# EAGLE design analogBoardV1_2 (EAGLE 6.4)
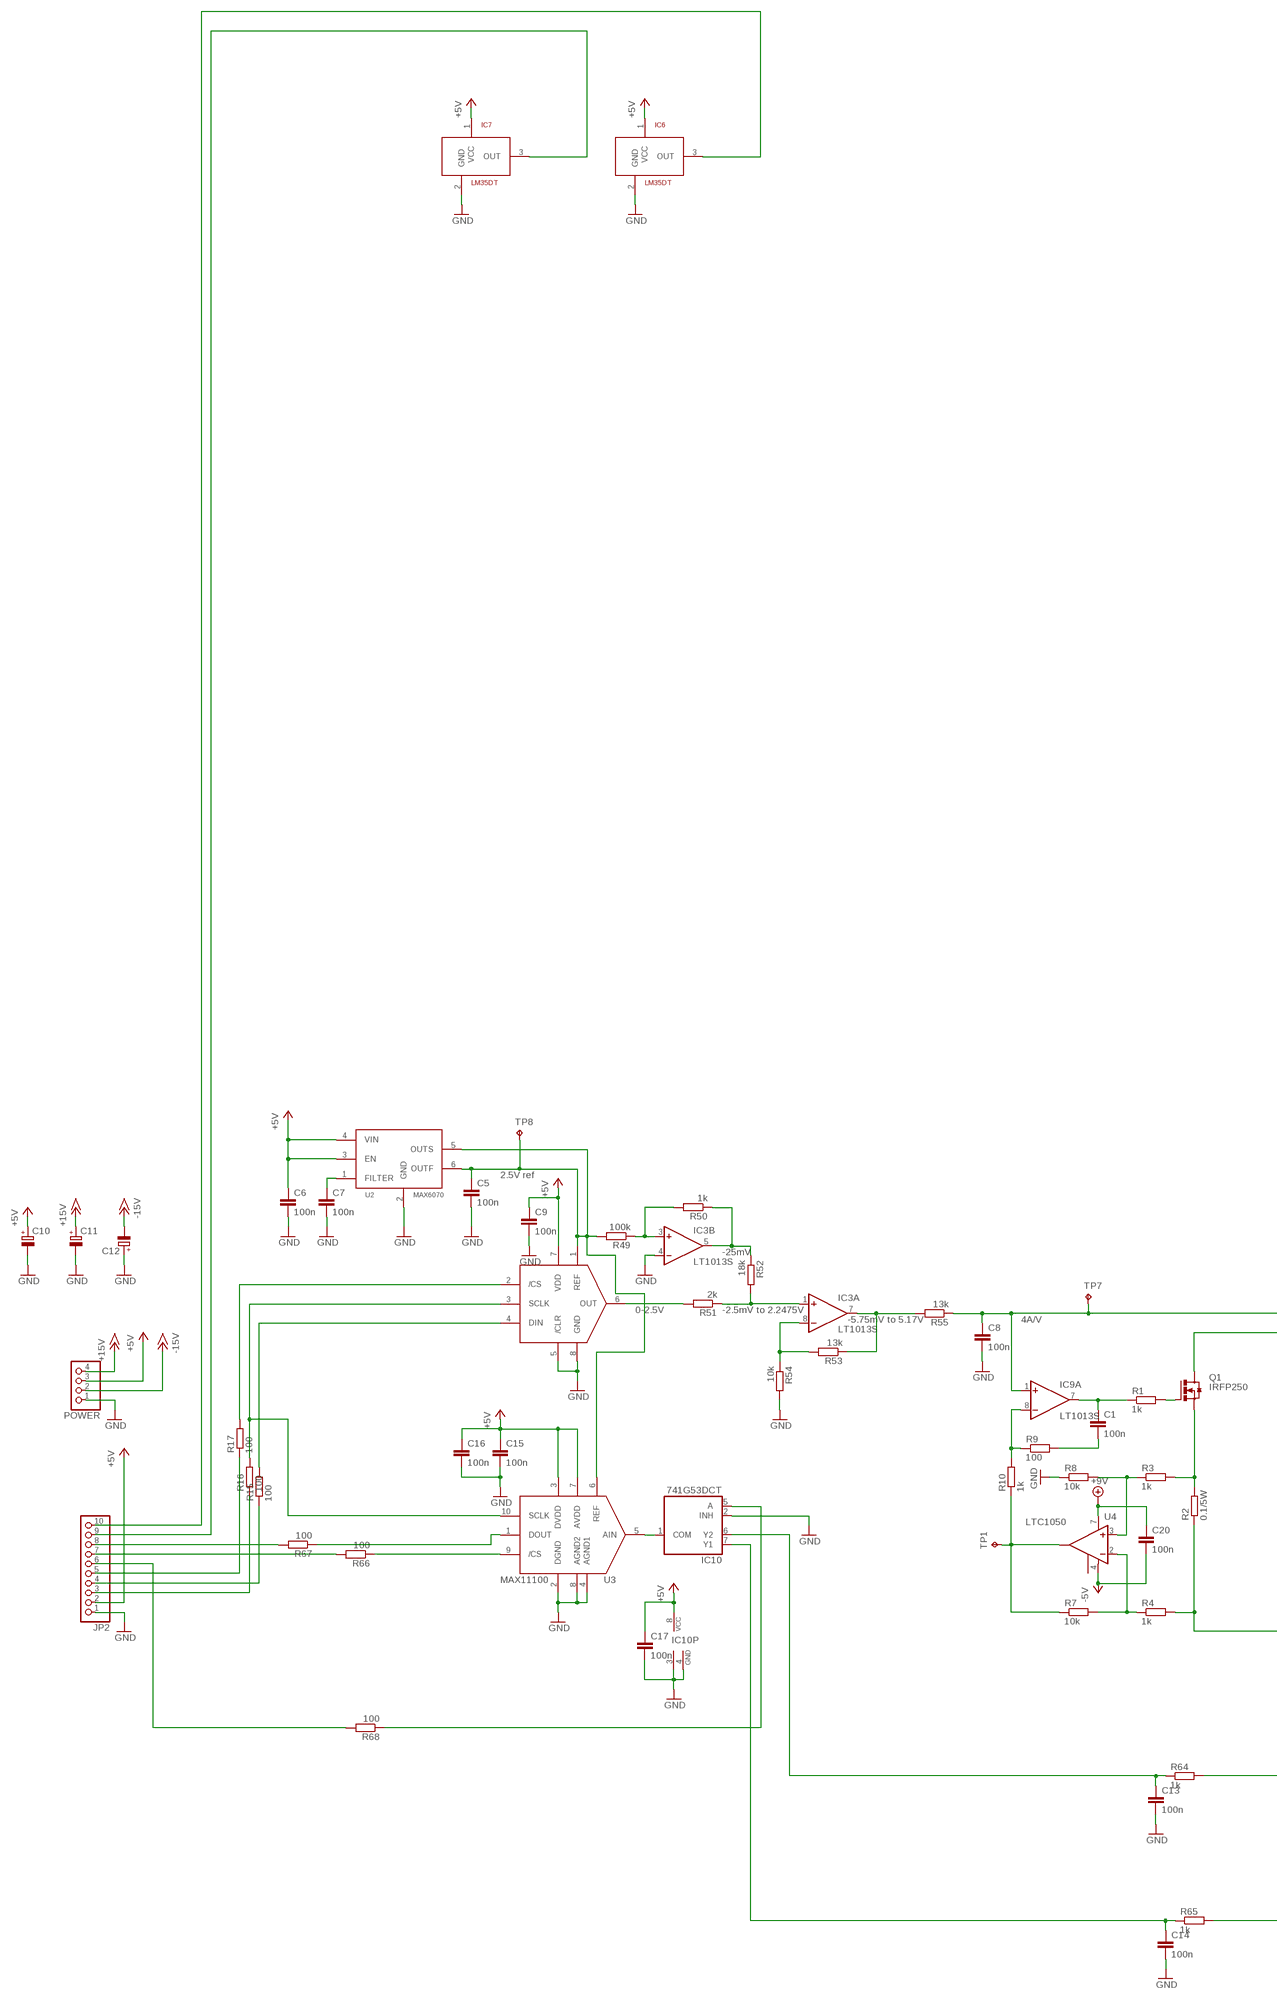
[diagram p0: schematic, sheet 1, part 1 of 2]
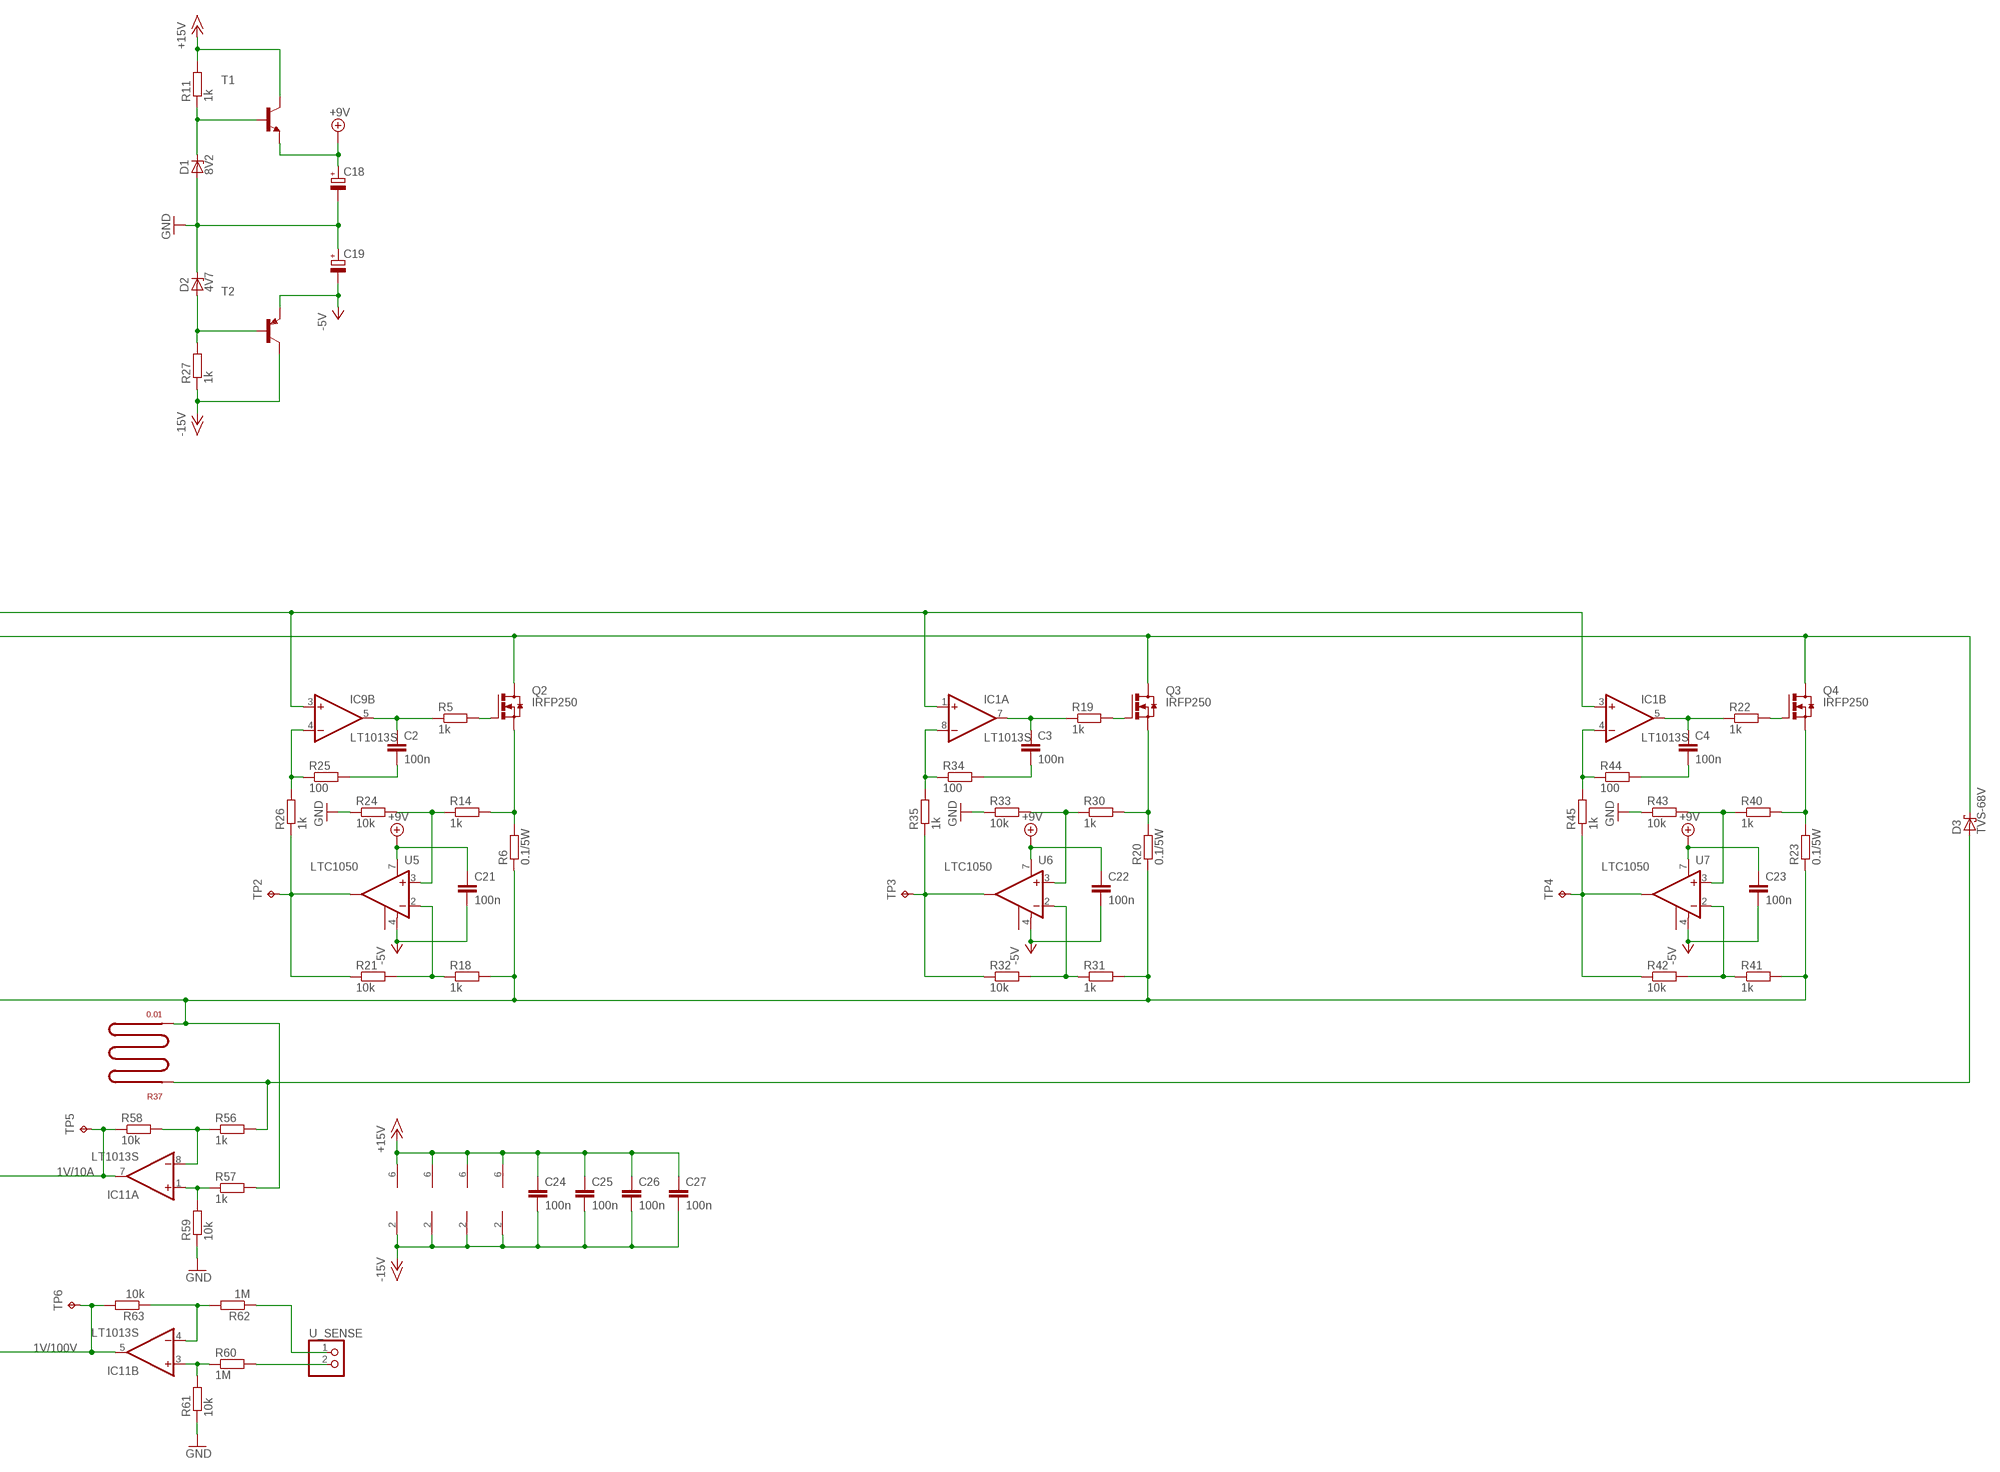
[diagram p1: schematic, sheet 1, part 2 of 2]

## Parts
C1  100n  C-EUC0603K  [C0603K]
C2  100n  C-EUC0603K  [C0603K]
C3  100n  C-EUC0603K  [C0603K]
C4  100n  C-EUC0603K  [C0603K]
C5  100n  C-EUC0603K  [C0603K]
C6  100n  C-EUC0603K  [C0603K]
C7  100n  C-EUC0603K  [C0603K]
C8  100n  C-EUC0603K  [C0603K]
C9  100n  C-EUC0603K  [C0603K]
C10  CPOL-EUE2.5-6  [E2,5-6]
C11  CPOL-EUE2.5-6  [E2,5-6]
C12  CPOL-EUE2.5-6  [E2,5-6]
C13  100n  C-EUC0603K  [C0603K]
C14  100n  C-EUC0603K  [C0603K]
C15  100n  C-EUC0603K  [C0603K]
C16  100n  C-EUC0603K  [C0603K]
C17  100n  C-EUC0603K  [C0603K]
C18  CPOL-EUE2.5-6  [E2,5-6]
C19  CPOL-EUE2.5-6  [E2,5-6]
C20  100n  C-EUC0603K  [C0603K]
C21  100n  C-EUC0603K  [C0603K]
C22  100n  C-EUC0603K  [C0603K]
C23  100n  C-EUC0603K  [C0603K]
C24  100n  C-EUC0603K  [C0603K]
C25  100n  C-EUC0603K  [C0603K]
C26  100n  C-EUC0603K  [C0603K]
C27  100n  C-EUC0603K  [C0603K]
D1  8V2  ZENER-DIODESOT23  [SOT23]
D2  4V7  ZENER-DIODESOT23  [SOT23]
D3  TVS-68V  SCHOTTKY-DIODECB429-15  [CB429-15]
IC1  LT1013S  [SO08]
IC3  LT1013S  [SO08]
IC6  LM35DT  [TO220V]
IC7  LM35DT  [TO220V]
IC9  LT1013S  [SO08]
IC10  741G53DCT  [DCT_R-PDSO-G8]
IC11  LT1013S  [SO08]
JP2  PINHD-1X10  [1X10]
POWER  PINHD-1X4  [1X04]
Q1  IRFP250  [TO-247AD-V]
Q2  IRFP250  [TO-247AD-V]
Q3  IRFP250  [TO-247AD-V]
Q4  IRFP250  [TO-247AD-V]
R1  1k  R-EU_R0603  [R0603]
R2  0.1/5W  5WAXIAL  [5WAXIAL]
R3  1k  R-EU_R0603  [R0603]
R4  1k  R-EU_R0603  [R0603]
R5  1k  R-EU_R0603  [R0603]
R6  0.1/5W  5WAXIAL  [5WAXIAL]
R7  10k  R-EU_R0603  [R0603]
R8  10k  R-EU_R0603  [R0603]
R9  100  R-EU_R0603  [R0603]
R10  1k  R-EU_R0603  [R0603]
R11  1k  R-EU_R0603  [R0603]
R14  1k  R-EU_R0603  [R0603]
R15  100  R-EU_R0603  [R0603]
R16  100  R-EU_R0603  [R0603]
R17  100  R-EU_R0603  [R0603]
R18  1k  R-EU_R0603  [R0603]
R19  1k  R-EU_R0603  [R0603]
R20  0.1/5W  5WAXIAL  [5WAXIAL]
R21  10k  R-EU_R0603  [R0603]
R22  1k  R-EU_R0603  [R0603]
R23  0.1/5W  5WAXIAL  [5WAXIAL]
R24  10k  R-EU_R0603  [R0603]
R25  100  R-EU_R0603  [R0603]
R26  1k  R-EU_R0603  [R0603]
R27  1k  R-EU_R0603  [R0603]
R30  1k  R-EU_R0603  [R0603]
R31  1k  R-EU_R0603  [R0603]
R32  10k  R-EU_R0603  [R0603]
R33  10k  R-EU_R0603  [R0603]
R34  100  R-EU_R0603  [R0603]
R35  1k  R-EU_R0603  [R0603]
R37  0.01  SHUNT  [COPPERSHUNT]
R40  1k  R-EU_R0603  [R0603]
R41  1k  R-EU_R0603  [R0603]
R42  10k  R-EU_R0603  [R0603]
R43  10k  R-EU_R0603  [R0603]
R44  100  R-EU_R0603  [R0603]
R45  1k  R-EU_R0603  [R0603]
R49  100k  R-EU_R0603  [R0603]
R50  1k  R-EU_R0603  [R0603]
R51  2k  R-EU_R0603  [R0603]
R52  18k  R-EU_R0603  [R0603]
R53  13k  R-EU_R0603  [R0603]
R54  10k  R-EU_R0603  [R0603]
R55  13k  R-EU_R0603  [R0603]
R56  1k  R-EU_R0603  [R0603]
R57  1k  R-EU_R0603  [R0603]
R58  10k  R-EU_R0603  [R0603]
R59  10k  R-EU_R0603  [R0603]
R60  1M  R-EU_R0603  [R0603]
R61  10k  R-EU_R0603  [R0603]
R62  1M  R-EU_R0603  [R0603]
R63  10k  R-EU_R0603  [R0603]
R64  1k  R-EU_R0603  [R0603]
R65  1k  R-EU_R0603  [R0603]
R66  100  R-EU_R0603  [R0603]
R67  100  R-EU_R0603  [R0603]
R68  100  R-EU_R0603  [R0603]
T1  BC817-16-NPN-SOT23-BEC  [SOT23-BEC]
T2  BC807-16-PNP-SOT23-BEC  [SOT23-BEC]
TP1  TPB1,27  [B1,27]
TP2  TPB1,27  [B1,27]
TP3  TPB1,27  [B1,27]
TP4  TPB1,27  [B1,27]
TP5  TPB1,27  [B1,27]
TP6  TPB1,27  [B1,27]
TP7  TPB1,27  [B1,27]
TP8  TPB1,27  [B1,27]
U1  MAX5216  [UMAX8]
U2  MAX6070  [SOT23-6L]
U3  MAX11100  [UMAX10]
U4  LTC1050  [SOIC8]
U5  LTC1050  [SOIC8]
U6  LTC1050  [SOIC8]
U7  LTC1050  [SOIC8]
U_SENSE  PINHD-1X2  [1X02]

## Nets
1M: R62.1 U_SENSE.1
+5V: C6.1 C9.1 C10.+ C15.1 C16.1 C17.1 IC6.1(VCC) IC7.1(VCC) IC10.8(VCC) JP2.2 POWER.3 U1.7(VDD) U2.3(EN) U2.4(VIN) U3.3(DVDD) U3.7(AVDD)
+9V: C18.+ C20.1 C21.1 C22.1 C23.1 T1.E U4.7(V+) U5.7(V+) U6.7(V+) U7.7(V+)
+15V: C11.+ C24.1 C25.1 C26.1 C27.1 IC1.6(P:V+) IC3.6(P:V+) IC9.6(P:V+) IC11.6(P:V+) POWER.4 R11.2 T1.C
-5V: C19.- C20.2 C21.2 C22.2 C23.2 T2.E U4.4(V-) U5.4(V-) U6.4(V-) U7.4(V-)
-15V: C12.- C24.2 C25.2 C26.2 C27.2 IC1.2(P:V-) IC3.2(P:V-) IC9.2(P:V-) IC11.2(P:V-) POWER.2 R27.1 T2.C
GND: C5.2 C6.2 C7.2 C8.2 C9.2 C10.- C11.- C12.+ C13.2 C14.2 C15.2 C16.2 C17.2 C18.- C19.+ D1.1(A) D2.3(C) IC3.4(B:-IN) IC6.2(GND) IC7.2(GND) IC10.2(INH) IC10.3(GND) IC10.4(GND) JP2.1 POWER.1 R8.1 R24.1 R33.1 R43.1 R54.2 R59.1 R61.1 U1.5(/CLR) U1.8(GND) U2.2(GND) U3.2(DGND) U3.4(AGND1) U3.8(AGND2)
N$1: R2.1 R4.2 R6.1 R18.2 R20.1 R23.1 R31.2 R37.P$2 R41.2 R57.2
N$2: Q1.G R1.2
N$3: Q1.S R2.2 R3.2
N$4: R4.1 R7.2 U4.2(-IN)
N$5: R3.1 R8.2 U4.3(+IN)
N$7: Q2.G R5.2
N$8: Q2.S R6.2 R14.2
N$9: C1.1 IC9.7(A:OUT) R1.1
N$10: C1.2 R9.2
N$11: R7.1 R10.1 TP1.TP U4.6(OUT)
N$12: IC9.8(A:-IN) R9.1 R10.2
N$13: D1.3(C) R11.1 T1.B
N$14: D2.1(A) R27.2 T2.B
N$15: Q3.G R19.2
N$18: R15.2 U1.4(DIN)
N$19: Q3.S R20.2 R30.2
N$21: R16.2 U1.3(SCLK) U3.10(SCLK)
N$22: R17.2 U1.2(/CS)
N$24: C8.1 IC1.1(A:+IN) IC1.3(B:+IN) IC9.1(A:+IN) IC9.3(B:+IN) R55.1 TP7.TP
N$25: C7.1 U2.1(FILTER)
N$26: Q4.G R22.2
N$27: Q4.S R23.2 R40.2
N$28: C5.1 R49.2 TP8.TP U1.1(REF) U2.5(OUTS) U2.6(OUTF) U3.6(REF)
N$29: R51.2 U1.6(OUT)
N$30: R18.1 R21.2 U5.2(-IN)
N$31: R14.1 R24.2 U5.3(+IN)
N$32: C2.1 IC9.5(B:OUT) R5.1
N$33: C2.2 R25.2
N$34: R21.1 R26.1 TP2.TP U5.6(OUT)
N$35: IC9.4(B:-IN) R25.1 R26.2
N$38: IC3.3(B:+IN) R49.1 R50.2
N$39: IC3.5(B:OUT) R50.1 R52.1
N$44: IC3.1(A:+IN) R51.1 R52.2
N$45: IC3.8(A:-IN) R53.2 R54.1
N$46: R31.1 R32.2 U6.2(-IN)
N$47: R30.1 R33.2 U6.3(+IN)
N$48: C3.1 IC1.7(A:OUT) R19.1
N$49: JP2.5 R17.1
N$50: JP2.3 R16.1
N$51: JP2.4 R15.1
N$52: C3.2 R34.2
N$53: IC6.3(OUT) JP2.10
N$54: IC7.3(OUT) JP2.9
N$55: R32.1 R35.1 TP3.TP U6.6(OUT)
N$56: IC1.8(A:-IN) R34.1 R35.2
N$64: IC3.7(A:OUT) R53.1 R55.2
N$65: IC10.1(COM) U3.5(AIN)
N$66: R41.1 R42.2 U7.2(-IN)
N$67: R40.1 R43.2 U7.3(+IN)
N$68: C4.1 IC1.5(B:OUT) R22.1
N$69: C4.2 R44.2
N$70: R42.1 R45.1 TP4.TP U7.6(OUT)
N$71: IC1.4(B:-IN) R44.1 R45.2
N$74: D3.A R37.P$1 R56.2
N$79: IC11.5(B:OUT) R63.2 R65.2 TP6.TP
N$80: IC11.8(A:-IN) R56.1 R58.2
N$81: IC11.1(A:+IN) R57.1 R59.2
N$82: C13.1 IC10.6(Y2) R64.1
N$83: IC11.7(A:OUT) R58.1 R64.2 TP5.TP
N$84: R60.2 U_SENSE.2
N$85: IC11.3(B:+IN) R60.1 R61.2
N$86: IC11.4(B:-IN) R62.2 R63.1
N$88: C14.1 IC10.7(Y1) R65.1
N$89: IC10.5(A) R68.1
N$90: JP2.7 R66.2
N$91: R67.1 U3.1(DOUT)
N$92: R66.1 U3.9(/CS)
N$93: JP2.8 R67.2
N$94: JP2.6 R68.2
POS_INPUT1: D3.C Q1.D Q2.D Q3.D Q4.D
Unconnected: U4.5(REFCLK) U5.5(REFCLK) U6.5(REFCLK) U7.5(REFCLK)

## Notes on the sheet
- 2.5V ref
- -25mV
- 0-2.5V | -2.5mV to 2.2475V
- -5.75mV to 5.17V | 4A/V
- 1V/10A
- 1V/100V

## Library data of the parts
C1-C9 C13-C17 C20-C27 = rcl:C-EU: CAPACITOR, European symbol
C10-C12 C18 C19 = rcl:CPOL-EU: POLARIZED CAPACITOR, European symbol
D1 D2 = diode:ZENER-DIODE: Z-Diode
D3 = diode:SCHOTTKY-DIODE: Schottky Diode
IC1 IC3 IC9 IC11 = synthdiy:LT1013: OP AMP
IC6 IC7 = customSensors:LM35DT
IC10 = 74xx-little-us:74*1G53: SINGLE-POLE DOUBLE-THROW (SPDT) ANALOG SWITCH 2:1 ANALOG MULTIPLEXER/DEMULTIPLEXER Source: http://focus.ti.com/lit/ds/symlink/sn74lvc2g53.pdf
JP2 = pinhead:PINHD-1X10: PIN HEADER
POWER = pinhead:PINHD-1X4: PIN HEADER
Q1-Q4 = transistor-power:IRFP25*: 33A/27A, 200V/150V, 0.085/0.012 Ohm, N-Channel Power MOSFET Source: Fairchild Semiconductor Corporation
R1 R3-R5 R7-R11 R14-R19 R21 R22 R24-R27 R30-R35 R40-R45 R49-R68 = resistor:R-EU_: RESISTOR, European symbol
R2 R6 R20 R23 = resistormod:5WAXIAL
R37 = customResistor:SHUNT
T1 = transistor:*-NPN-: NPN Transistror BF959 corrected 2008.03.06
T2 = transistor:*-PNP-: PNP Transistror
TP1-TP8 = testpad:TP: Test pad
U1 = maxim:MAX5216
U2 = maxim:MAX6070
U3 = maxim:MAX11100
U4-U7 = linear-technology:LTC1050
U_SENSE = pinhead:PINHD-1X2: PIN HEADER

## Board
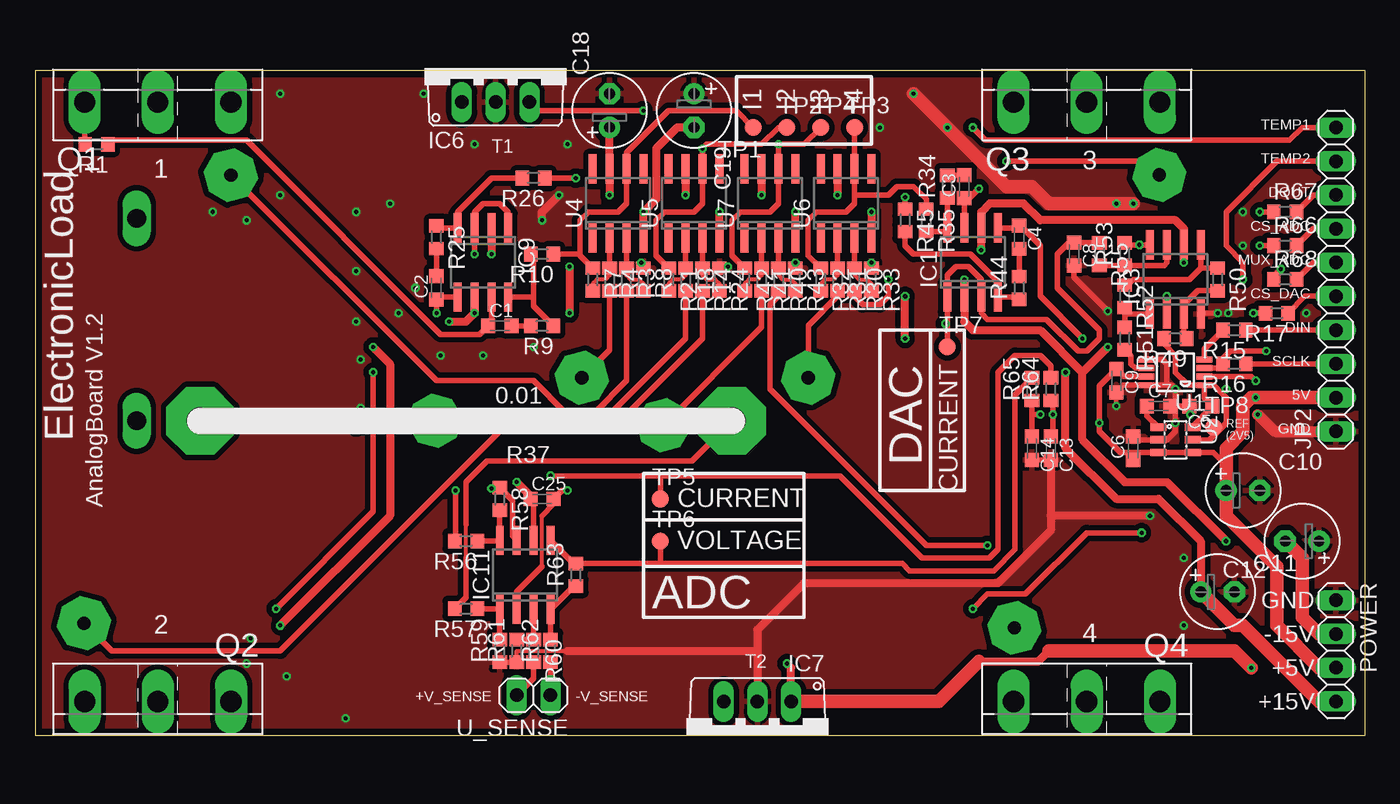
[diagram p2: board, top side]
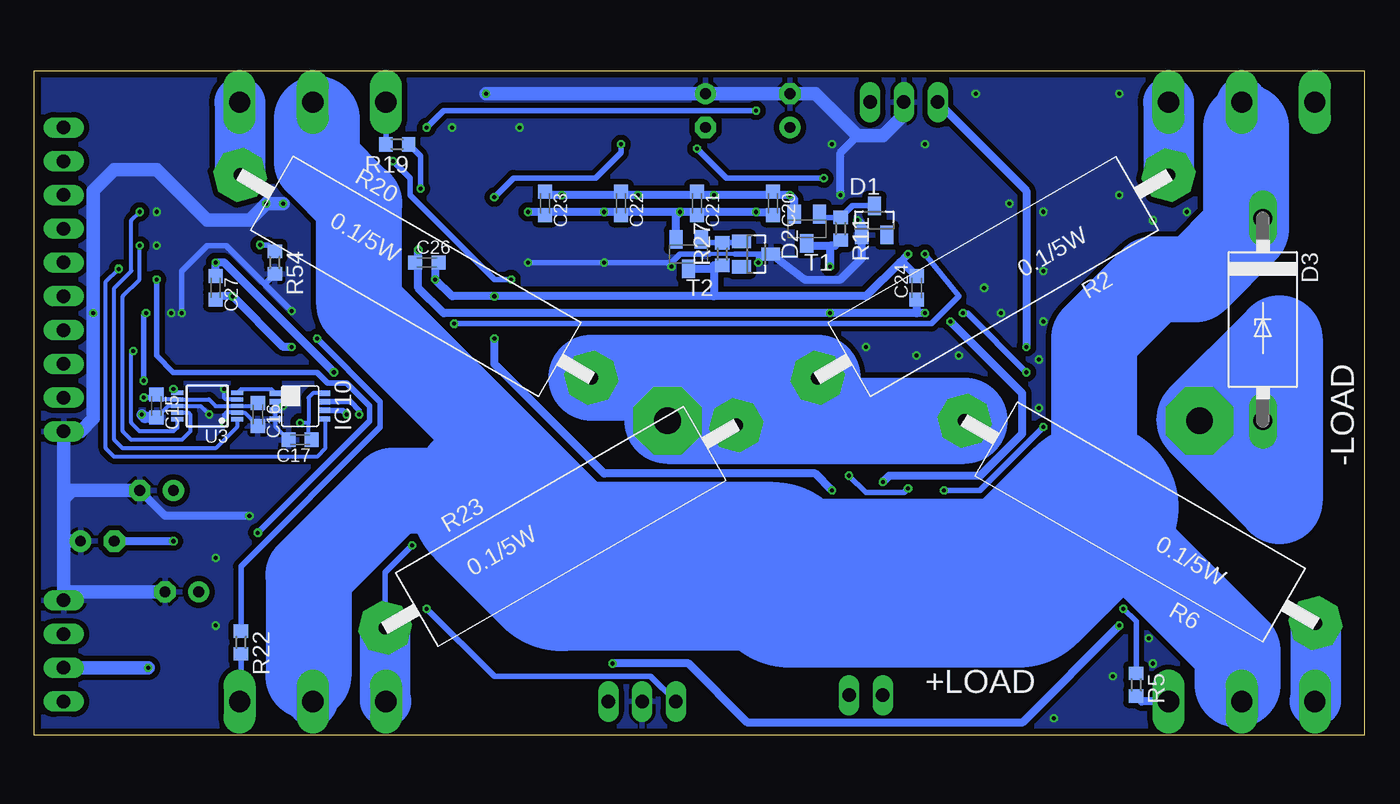
[diagram p3: board, bottom side, seen from below]

Size 100 x 50 mm. Coordinates in mm from the lower left corner, seen from the top.
Outline: 0,0 100,0 100,50 0,50 0,0
Copper layers (1*16): Top 0.035mm / dielectric 1.6mm / Bottom 0.035mm
Design rules "Elecrow_2-layer_PCB_eagle_rule": minimum track width 6mil, minimum drill 12mil, track to track 6mil, track to pad 6mil, pad to pad 6mil, via to via 8mil, smd to smd 0mil, copper to edge 20mil, drill to drill 10mil, minimum pad ring 6mil, minimum via ring 6mil, stop-mask expansion 0mil, vias tented up to drill 100mil, thermal gap 10mil

### Footprints (pad centres in the part's own frame; a part is rotated, then mirrored left to right if it is on the bottom)
C0603K = smd 1.05 x 1.08: 1 -0.875,0; 2 0.875,0
E2,5-6 = drill 0.813 pad 1.6: + -1.27,0 | drill 0.813 pad 1.6 octagon: - 1.27,0
SOT23 = smd 1 x 1.4: 1 -0.95,-1.1; 2 0.95,-1.1; 3 0,1.1
CB429-15 = drill 1.397 long: A 7.62,0; C -7.62,0
SO08 = smd 0.6 x 2.2: 1 -1.905,-2.6; 2 -0.635,-2.6; 3 0.635,-2.6; 4 1.905,-2.6; 5 1.905,2.6; 6 0.635,2.6; 7 -0.635,2.6; 8 -1.905,2.6
TO220V = drill 1.016 long: 1 -2.54,-2.54; 2 0,-2.54; 3 2.54,-2.54
DCT_R-PDSO-G8 = smd 0.4 x 0.8: 1 -0.975,-1.875; 2 -0.325,-1.875; 3 0.325,-1.875; 4 0.975,-1.875; 5 0.975,1.875; 6 0.325,1.875; 7 -0.325,1.875; 8 -0.975,1.875
1X10 = drill 1.016 long: 1 -11.43,0; 2 -8.89,0; 3 -6.35,0; 4 -3.81,0; 5 -1.27,0; 6 1.27,0; 7 3.81,0; 8 6.35,0; 9 8.89,0; 10 11.43,0
1X04 = drill 1.016 long: 1 -3.81,0; 2 -1.27,0; 3 1.27,0; 4 3.81,0
TO-247AD-V = drill 1.6 long: D 0,-2.54; G -5.5,-2.54; S 5.5,-2.54
R0603 = smd 1 x 1.1: 1 -0.85,0; 2 0.85,0
5WAXIAL = drill 1 pad 3.81 octagon: 1 15.24,0; 2 -15.24,0
COPPERSHUNT = drill 2 pad 5.08 octagon: P$1 20,0; P$2 -20,0
SOT23-BEC = smd 1 x 1.4: B -0.95,-1.1; C 0,1.1; E 0.95,-1.1
B1,27 = smd 1.27 x 1.27: TP 0,0
UMAX8 = smd 0.45 x 1.2: 1 -0.975,-2.175; 2 -0.325,-2.175; 3 0.325,-2.175; 4 0.975,-2.175; 5 0.975,2.175; 6 0.325,2.175; 7 -0.325,2.175; 8 -0.975,2.175
SOT23-6L = smd 0.55 x 1.2: 1 -0.95,-1.3; 2 0,-1.3; 3 0.95,-1.3; 4 0.95,1.3; 5 0,1.3; 6 -0.95,1.3
UMAX10 = smd 0.32 x 0.9: 1 -1,-2.25; 2 -0.5,-2.25; 3 0,-2.25; 4 0.5,-2.25; 5 1,-2.25; 6 1,2.25; 7 0.5,2.25; 8 0,2.25; 9 -0.5,2.25; 10 -1,2.25
SOIC8 = smd 0.6 x 2.2: 1 -1.905,-2.6; 2 -0.635,-2.6; 3 0.635,-2.6; 4 1.905,-2.6; 5 1.905,2.6; 6 0.635,2.6; 7 -0.635,2.6; 8 -1.905,2.6
1X02 = drill 1.016 long: 1 -1.27,0; 2 1.27,0

### Placement (x,y rotation side)
C1  34.92,30.8 0 top
C2  30.16,33.66 90 top
C3  69.85,41.27 90 top
C4  73.98,37.47 270 top
C5  87.63,24.77 180 top
C6  82.55,21.59 90 top
C7  84.45,24.77 0 top
C8  78.11,36.2 270 top
C9  81.28,26.67 270 top
C10  90.81,18.41 0 top
C11  88.9,10.79 0 top
C12  95.25,14.61 180 top
C13  76.36,21.59 270 top
C14  74.93,21.59 270 top
C15  90.81,24.77 270 bottom
C16  83.19,24.13 270 bottom
C17  80.01,22.23 180 bottom
C18  43.18,46.99 90 top
C19  49.53,46.99 270 top
C20  44.45,40.01 270 bottom
C21  50.16,40.01 270 bottom
C22  55.88,40.01 270 bottom
C23  61.59,40.01 270 bottom
C24  33.66,33.66 90 bottom
C25  38.1,17.78 0 top
C26  70.48,35.56 0 bottom
C27  86.36,33.66 270 bottom
D1  36.83,38.73 0 bottom
D2  45.72,36.2 270 bottom
D3  7.62,31.27 270 bottom
IC1  70.48,35.56 0 top
IC3  85.72,34.29 0 top
IC6  34.61,50.16 0 top
IC7  54.29,0 180 top
IC9  33.66,35.56 180 top
IC10  80.01,24.77 270 bottom
IC11  36.83,12.06 0 top
JP2  97.79,34.29 90 top
POWER  97.79,6.35 270 top
Q1  9.21,50.16 0 top
Q2  9.21,0 180 top
Q3  79.06,50.16 0 top
Q4  79.06,0 180 top
R1  4.6,44.45 180 top
R2  27.9,34.52 210 bottom
R3  44.45,34.29 270 top
R4  43.18,34.29 270 top
R5  17.14,3.81 270 bottom
R6  16.85,16.05 150 bottom
R7  41.91,34.29 270 top
R8  45.72,34.29 270 top
R9  38.1,30.8 180 top
R10  38.1,36.2 180 top
R11  39.37,38.1 270 bottom
R14  50.16,34.29 270 top
R15  90.17,30.48 180 top
R16  90.17,27.94 180 top
R17  93.34,31.75 180 top
R18  48.9,34.29 270 top
R19  72.71,44.45 180 bottom
R20  71.32,34.52 330 bottom
R21  47.62,34.29 270 top
R22  84.45,6.99 270 bottom
R23  60.42,15.7 30 bottom
R24  51.44,34.29 270 top
R25  30.16,37.47 270 top
R26  37.47,41.91 180 top
R27  48.26,36.2 90 bottom
R30  61.59,34.29 270 top
R31  60.33,34.29 270 top
R32  59.05,34.29 270 top
R33  62.87,34.29 270 top
R34  68.58,41.27 90 top
R35  66.99,38.73 270 top
R37  32.38,23.65 180 top
R40  55.88,34.29 270 top
R41  54.61,34.29 270 top
R42  53.34,34.29 270 top
R43  57.15,34.29 270 top
R44  73.98,33.66 90 top
R45  65.41,38.73 270 top
R49  85.72,29.84 180 top
R50  88.9,34.29 270 top
R51  81.92,29.84 270 top
R52  81.92,33.02 270 top
R53  81.92,36.2 90 top
R54  81.92,35.56 270 bottom
R55  80.01,36.2 270 top
R56  32.38,14.61 180 top
R57  32.38,9.53 180 top
R58  34.92,17.78 270 top
R59  34.92,6.35 90 top
R60  37.47,6.35 270 top
R61  36.2,6.35 90 top
R62  38.73,6.35 90 top
R63  40.64,12.06 90 top
R64  76.36,26.04 90 top
R65  74.93,26.04 90 top
R66  93.98,36.83 0 top
R67  93.98,39.37 0 top
R68  93.98,34.29 0 top
T1  41.91,38.1 180 bottom
T2  50.8,36.2 180 bottom
TP1  53.98,45.72 180 top
TP2  56.52,45.72 0 top
TP3  61.59,45.72 0 top
TP4  59.05,45.72 0 top
TP5  46.99,17.78 0 top
TP6  46.99,14.61 0 top
TP7  68.58,29.21 0 top
TP8  88.58,23.18 0 top
U1  85.72,27.3 90 top
U2  85.72,22.23 270 top
U3  87,24.77 90 bottom
U4  43.81,40.01 0 top
U5  49.53,40.01 0 top
U6  60.96,40.01 0 top
U7  55.24,40.01 0 top
U_SENSE  37.47,3.02 180 top

### Tracks (layer width: path | path; a pad name or v marks a point on that pad's centre or on a via)
1M
  Top 0.406: U_SENSE.1 R62.1
+5V  (via drill 0.3)
  Top 0.406: U1.7 81.84,26.98 C9.1 80.01,26.27 v80.01,23.5 80.01,22.86 81.59,21.27 82.55,21.27 | 82.55,21.27 U2.3 U2.4 88.58,21.27 89.53,20.32 C10.+ | 82.55,21.27 C6.1
  Top 0.61: v25.4,29.21 26.67,27.94 26.67,16.51 v18.41,8.26 | 70.96,5.56 75.41,5.56 76.2,6.35 | IC7.1 56.83,5.08 v56.52,5.4
  Top 1.016: POWER.3 96.52,5.08 93.34,8.26 93.34,12.7 89.53,16.51 C10.+ 89.53,21.59 90.81,22.86 90.81,24.77 91.44,25.4 v91.76,25.4 JP2.2 | IC7.1 67.94,2.54 70.96,5.56 | 76.2,6.35 90.17,6.35 v91.44,5.08
  Bottom 0.305: C15.1 90.43,25.27 U3.7 86.86,25.27 86.36,24.77 U3.3 83.42,24.77 C16.1 | IC10.8 79.03,25.74 79.38,25.4 79.38,23.5 | C17.1 79.38,22.46 79.38,23.5 | 79.38,23.5 v80.01,23.5
  Bottom 0.406: v91.76,25.4 91.05,25.4 C15.1
  Bottom 0.61: IC6.1 25.4,40.96 v25.4,29.21 | v18.41,8.26 25.72,0.95 46.35,0.95 50.8,5.4 v56.52,5.4
  Bottom 1.016: v91.44,5.08 POWER.3
+9V  (via drill 0.3)
  Top 0.61: U5.7 v48.9,40.64 | v43.18,40.64 U4.7 C18.+ | U7.7 v54.61,40.64 | U6.7 v60.33,40.64
  Bottom 0.406: C20.1 44.45,40.64
  Bottom 0.61: 50.16,40.64 v48.9,40.64 44.45,40.64 v43.18,40.64 42.86,40.32 T1.E | 50.16,40.64 v54.61,40.64 55.88,40.64 | 55.88,40.64 v60.33,40.64 61.35,40.64 C23.1 | C21.1 50.16,40.64 | C22.1 55.88,40.64
+15V  (via drill 0.3)
  Top 0.406: IC11.6 37.47,17.54 C25.1
  Top 0.61: v77.47,27.3 77.47,21.59 81.28,17.78 84.45,17.78 87.63,14.61 C11.+ | v86.36,35.56 IC3.6 86.36,38.1 85.72,38.73 75.56,38.73 74.3,40.01 71.75,40.01 71.12,39.37 IC1.6 v71.12,36.51 | IC9.6 v33.02,31.75 32.38,31.11 v31.11,31.11 | v40.16,35.24 v40.16,31.75 | C25.1 37.23,18.02 v36.2,19.05
  Top 1.016: POWER.4 96.52,2.54 90.81,8.26 90.17,8.26 C11.+
  Bottom 0.61: v77.47,27.3 85.72,35.56 v86.36,35.56 C27.1 | v33.02,31.75 33.66,31.75 | 33.66,31.75 v40.16,31.75 69.22,31.75 71.12,33.66 71.12,35.56 | 71.12,35.56 v71.12,36.51 | T1.C 41.74,36.83 40.16,36.83 | R11.2 39.79,36.83 40.16,36.83 | 40.16,36.83 v40.16,35.24 | C24.1 33.66,31.75 | C26.1 71.12,35.56 | v31.11,31.11 25.72,25.72 25.72,22.7 28.89,19.53 35.72,19.53 v36.2,19.05
-5V  (via drill 0.3)
  Top 0.61: U4.4 v45.72,39.37 46.67,40.32 46.67,44.13 48.26,45.72 C19.- | v62.87,39.37 U6.4 | U7.4 v57.15,39.37 | U5.4 v51.44,39.37
  Bottom 0.61: 50.16,39.37 v45.72,39.37 44.69,39.37 C20.2 | 50.16,39.37 v51.44,39.37 | v51.44,39.37 55.88,39.37 | 55.88,39.37 v57.15,39.37 61.59,39.37 | 61.59,39.37 v62.87,39.37 | T2.E 51.75,39.05 v51.44,39.37 | C21.2 50.16,39.37 | C22.2 55.88,39.37 | C23.2 61.59,39.37
-15V  (via drill 0.3)
  Top 0.305: 38.1,12.7 38.1,16.51
  Top 0.406: IC11.2 36.2,10.79 38.1,12.7 | 38.1,16.51 38.98,17.39 C25.2 39.61,18.41 v40.01,18.41
  Top 0.61: v85.09,33.02 IC3.2 | 78.74,27.3 78.74,22.23 81.92,19.05 85.09,19.05 v89.53,14.61 | 78.74,27.3 v80.64,29.21 | IC9.2 v34.29,36.2 | v69.85,34.29 IC1.2 69.85,31.11 70.48,30.48 75.56,30.48 78.74,27.3 | v65.41,29.84 v65.41,33.02
  Top 1.016: POWER.2 96.52,7.62 95.25,8.89 95.25,13.34 C12.-
  Bottom 0.61: v80.64,29.21 81.28,29.21 v85.09,33.02 86.12,33.02 C27.2 | C12.- v89.53,14.61 | v34.29,36.2 34.92,35.56 | 34.92,35.56 37.47,33.02 48.9,33.02 | 48.9,33.02 v65.41,33.02 68.58,33.02 v69.85,34.29 69.85,35.32 C26.2 | T2.C 49.15,35.09 R27.1 48.9,35.34 48.9,33.02 | C24.2 34.69,35.56 34.92,35.56 | v65.41,29.84 65.41,27.94 57.15,19.68 41.27,19.68 v40.01,18.41
GND  (via drill 0.3)
  Top 0.305: v81.28,24.77 C9.2 | R61.1 36.2,6.35 40.01,6.35
  Top 0.406: 85.72,24.77 C5.2 86.75,24.37 v86.84,24.13 | C6.2 82.79,22.23 U2.2 85.09,22.23 85.72,22.86 v85.72,23.5 85.72,24.77 | 85.72,24.77 C7.2 | 85.09,26.33 U1.8 81.81,26.33 C9.2 | 85.09,26.33 85.43,26.33 v85.72,26.04 85.72,24.77 | U1.5 84.75,28.28 85.09,27.94 85.09,26.33 | R33.1 v62.87,35.56 | R43.1 v57.15,35.56 | v52.07,35.24 51.97,35.14 R24.1 | R8.1 45.56,35.3 v45.56,35.56 | IC3.4 87.69,31.75 v88.9,31.75 | R59.1 R61.1 | C14.2 C13.2 | C8.2 78.11,34.45 v80.64,31.91
  Top 0.61: C13.2 76.36,16.51 | 76.36,16.51 76.36,15.4 72.39,11.43 57.78,11.43 54.29,7.94 54.29,6.35 | v83.82,16.51 76.36,16.51 | v38.1,38.73 38.1,39.37 v39.37,40.64 | 54.29,6.35 IC7.2 | 40.01,6.35 54.29,6.35
  Top 0.813: v91.92,24.13 93.19,22.86 JP2.1
  Top 1.016: v66.04,48.26 73.03,41.27 74.93,41.27 76.2,40.01 v82.55,40.01
  Bottom 0.305: C15.2 89.93,24.77 U3.8 87.47,24.77 v86.84,24.13 | C16.2 84.19,24.27 U3.2 85.59,24.27 85.72,24.13 v85.72,23.5 | C17.2 81.89,23.23 IC10.4 IC10.3 IC10.2 81.89,24.8 81.92,24.77 v81.28,24.77 | U3.4 85.59,25.27 85.72,25.4 v85.72,26.04 | 47.31,36.2 49.21,36.2
  Bottom 0.406: v62.87,35.56 v57.15,35.56 52.39,35.56 v52.07,35.24 52.07,35.56 51.44,36.2 49.21,36.2 | D2.3 45.72,36.2 | v45.56,35.56 45.56,36.04 45.72,36.2 | 45.72,36.2 47.31,36.2 | v80.64,31.91 82.79,34.05 | 82.79,34.05 85.57,36.83 87,36.83 88.9,34.92 v88.9,31.75 | R54.2 82.57,34.05 82.79,34.05
  Bottom 0.61: D2.3 42.08,34.29 39.37,34.29 37.78,35.88 D1.1 37.78,38.41 v38.1,38.73 | v83.82,16.51 90.17,16.51 C10.- | v39.37,40.64 39.37,43.81 38.1,45.09
  Bottom 0.813: C15.2 91.68,23.89 v91.92,24.13
  Bottom 1.016: POWER.1 97.79,10.79 | 97.79,10.79 97.79,14.61 | 97.79,14.61 97.79,17.78 | 97.79,17.78 97.79,18.41 | 97.16,18.41 97.79,17.78 | C12.+ 97.79,14.61 | C11.- 97.79,10.79 | C10.- 97.79,18.41 | 97.79,18.41 JP2.1 96.52,22.86 95.57,23.81 v95.57,31.75 95.57,40.96 93.98,42.55 90.81,42.55 87,38.73 83.82,38.73 v82.55,40.01 v81.28,40.01 | IC6.2 34.61,46.67 36.2,45.09 38.1,45.09 41.27,48.26 C18.- C19.+ v66.04,48.26
  other vias: 23.34,1.27 18.89,4.45 63.5,45.72 68.58,45.72 40.01,44.45 33.02,44.45 28.57,33.66 26.67,40.01 24.13,39.37 29.21,48.26 18.41,48.26 24.13,34.92 18.41,40.64 27.3,31.75 13.34,39.37 15.88,38.73 24.13,31.11 24.45,24.61 24.45,28.26 30.48,28.57 33.66,28.57 37.47,29.21 15.88,5.4 16.19,7.3 86.36,13.34 86.36,8.26 90.81,36.83 90.81,39.37 89.69,31.75
  pour Top (isolate 0.406): -1.27,51.44 100.97,51.44 100.97,-0.64 -1.27,-0.64
  pour Bottom (isolate 0.406): -0.64,50.8 101.6,50.8 101.6,-1.27 -0.64,-1.27
N$1
  Top 0.305: 32.38,13.34 32.38,15.88
  Top 0.406: R4.2 43.18,28.98 R2.1 | R18.2 48.9,29.84 42.72,23.66 R6.1 | R41.2 54.61,30.71 R23.1 | R31.2 60.33,33.02 58.12,30.82 R20.1 | R57.2 32.38,10.38 32.38,13.34 | 32.38,15.88 32.38,19.05 33.97,20.64 49.37,20.64 R37.P$2
  Bottom 0.406: 51.68,26.9 50.8,26.9
  Bottom 0.61: R23.1 47.29,23.32 47.62,23.65
  Bottom 6.452: R20.1 50.8,26.9 | 50.8,26.9 R2.1 | 50.8,26.9 47.57,23.66 R6.1 30.06,23.65 47.62,23.65 R37.P$2
N$2
  Top 0.406: Q1.G 3.71,44.5 R1.2
N$3
  Top 0.406: R3.2 44.45,26.67 42.07,24.29 39.85,24.29 37.47,26.67 30.17,26.67 R2.2
  Bottom 3.81: Q1.S R2.2
N$4
  Top 0.305: R4.1 43.18,34.61 42.86,34.29 42.23,34.29 41.91,33.97 R7.2
  Top 0.406: U4.2 R4.1
N$5
  Top 0.305: R3.1 44.45,34.61 44.77,34.29 45.4,34.29 45.72,33.97 R8.2
  Top 0.406: U4.3 R3.1
N$7
  Bottom 0.61: Q2.G 16.73,2.54 R5.2
N$8
  Top 0.406: R14.2 50.16,29.84 43.18,22.86 34.92,22.86 18.41,6.35 5.73,6.35 R6.2 3.8,8.26
  Bottom 3.81: Q2.S 3.65,2.6 R6.2
N$9
  Top 0.406: IC9.7 34.29,31.04 C1.1 33.41,30.16 30.48,30.16 15.88,44.77 5.77,44.77 R1.1
N$10
  Top 0.406: C1.2 R9.2
N$11
  Top 0.406: R7.1 40.96,36.09 40.96,36.2 | 40.96,36.2 40.96,38.73 41.59,39.37 43.81,39.37 44.45,40.01 U4.6 44.45,43.81 47.62,46.99 52.7,46.99 TP1.TP | R10.1 40.96,36.2
N$12
  Top 0.406: R10.2 37.47,36.2 37.47,33.02 | IC9.8 37.41,32.96 37.47,33.02 | 37.47,33.02 37.47,32.28 R9.1
N$13
  Bottom 0.406: T1.B 40.71,38.95 R11.1 38.48,39.84 D1.3
N$14
  Bottom 0.406: 49.6,37.68 T2.B 49.6,37.05 R27.2 46.92,37.05 D2.1
N$15
  Bottom 0.406: R19.2 Q3.G
N$18
  Top 0.406: R15.2 87.9,29.06 U1.4
N$19  (via drill 0.3)
  Top 0.406: v64.14,34.29 64.14,33.02 63.5,32.38 62.23,32.38 61.59,33.02 R30.2 | R20.2 83.48,43.18 v73.03,43.18
  Bottom 0.406: v64.14,34.29 65.41,34.29 71.75,40.64 71.75,41.91 v73.03,43.18
  Bottom 3.81: Q3.S 84.52,47.59 R20.2
N$21  (via drill 0.3)
  Top 0.406: U1.3 89.01,27.63 R16.2 89.32,28.36 89.86,28.9 v92.55,28.9
  Bottom 0.305: U3.10 89.25,23.15 89.53,22.86 92.08,22.86 92.71,23.5 92.71,28.74 v92.55,28.9
N$22  (via drill 0.3)
  Top 0.406: U1.2 91.45,26.98 v91.76,26.67 | v91.6,31.75 R17.2
  Bottom 0.406: v91.76,26.67 91.76,31.59 v91.6,31.75
N$24  (via drill 0.3)
  Top 0.406: v33.02,36.2 IC9.3 33.02,39.37 33.66,40.01 34.92,40.01 35.56,39.37 IC9.1 | 68.58,31.11 68.58,32.38 IC1.1 68.58,34.61 69.22,35.24 70.17,35.24 71.12,34.29 IC1.3 71.12,31.75 71.6,31.27 76.04,31.27 78.42,28.89 79.06,28.89 80.01,29.84 80.01,30.48 76.83,33.66 76.83,36.2 77.71,37.07 C8.1 79.98,37.07 R55.1 | 68.58,31.11 v68.42,30.96 | TP7.TP 68.58,31.11
  Bottom 0.406: v33.02,36.2 30.48,33.02 32.54,30.96 v68.42,30.96
N$25
  Top 0.406: U2.1 83.58,24.02 C7.1
N$26
  Bottom 0.406: R22.2 84.45,2.64 Q4.G
N$27  (via drill 0.3)
  Top 0.406: R40.2 55.88,33.02 55.24,32.38 55.24,26.04 66.99,14.29 v71.6,14.29
  Bottom 0.406: R23.2 73.62,12.27 v71.6,14.29
  Bottom 3.81: Q4.S 73.62,2.6 R23.2
N$28  (via drill 0.3)
  Top 0.254: TP8.TP 88.9,22.86
  Top 0.305: v89.53,26.04 89.22,25.72
  Top 0.406: U2.6 87.03,23.29 C5.1 87.9,25.37 U1.1 | U2.5 88.27,22.23 88.9,22.86 89.53,23.5 89.53,25.4 89.22,25.72 88.61,26.33 U1.1 | U1.1 86.7,26.33 85.72,27.3 85.72,28.57 84.88,29.43 R49.2 85.09,29.63
  Bottom 0.305: U3.6 89.27,25.77 v89.53,26.04
N$29
  Top 0.406: U1.6 82.7,27.63 82.39,27.94 82.39,28.52 R51.2
N$30
  Top 0.305: R18.1 48.9,34.61 48.58,34.29 47.94,34.29 47.62,33.97 R21.2
  Top 0.406: U5.2 R18.1
N$31
  Top 0.305: R14.1 50.16,34.61 50.48,34.29 51.12,34.29 51.44,33.97 R24.2
  Top 0.406: U5.3 R14.1
N$32  (via drill 0.3)
  Top 0.406: IC9.5 30.34,32.96 C2.1 v30.16,31.75 | v18.1,9.53 25.4,16.83 v25.4,27.3
  Bottom 0.406: v25.4,27.3 29.84,31.75 v30.16,31.75 | R5.1 17.14,8.57 v18.1,9.53
N$33
  Top 0.406: C2.2 R25.2
N$34  (via drill 0.3)
  Top 0.406: R21.1 46.67,36.09 46.67,38.73 47.31,39.37 49.53,39.37 50.16,40.01 U5.6 v50.16,44.13 50.48,44.45 54.61,44.45 55.88,45.72 TP2.TP | R26.1 v40.64,41.91
  Bottom 0.406: v40.64,41.91 47.94,41.91 v50.16,44.13
N$35
  Top 0.406: R26.2 34.29,41.91 31.75,39.37 IC9.4 30.32,38.16 R25.1
N$38
  Top 0.406: R50.2 87.42,33.44 86.36,32.38 IC3.3 86.36,30.06 R49.1
N$39
  Top 0.406: 87.63,35.14 R50.1 | IC3.5 87.63,35.14 | R52.1 82.13,33.87 82.55,34.29 86.78,34.29 87.63,35.14
N$44
  Top 0.406: R51.1 81.92,31.75 | IC3.1 81.97,31.69 81.92,31.75 | 81.92,31.75 R52.2
N$45  (via drill 0.3)
  Top 0.406: IC3.8 v83.03,36.89 82.07,36.89 R53.2
  Bottom 0.406: R54.1 82.39,36.89 v83.03,36.89
N$46
  Top 0.305: R31.1 60.33,34.61 60.01,34.29 59.37,34.29 59.05,33.97 R32.2
  Top 0.406: U6.2 R31.1
N$47
  Top 0.305: R30.1 61.59,34.61 61.91,34.29 62.55,34.29 62.87,33.97 R33.2
  Top 0.406: U6.3 R30.1
N$48  (via drill 0.3)
  Top 0.406: IC1.7 C3.1 70.25,40.4 v70.96,41.12
  Bottom 0.406: R19.1 70.96,43.55 v70.96,41.12
N$49
  Top 0.406: JP2.5 95.47,33.02 R17.1
N$50
  Top 0.406: R16.1 JP2.3
N$51
  Top 0.406: R15.1 JP2.4
N$52
  Top 0.406: R34.2 69.83,42.12 C3.2
N$53  (via drill 0.3)
  Top 0.406: IC6.3 37.78,46.99 v45.72,46.99 | v70.48,45.72 71.44,44.77 94.3,44.77 95.25,45.72 JP2.10
  Bottom 0.406: v45.72,46.99 69.22,46.99 v70.48,45.72
N$54  (via drill 0.3)
  Top 0.406: JP2.9 93.34,43.18 89.53,39.37 89.53,36.83 90.81,35.56 v90.81,34.29 | v70.48,9.53 71.6,10.64 74.45,10.64 79.06,15.24 v83.19,15.24
  Bottom 0.406: v90.81,34.29 90.81,28.57 89.53,27.3 78.74,27.3 77.95,26.51 76.52,26.51 74.77,24.77 74.77,23.65 v83.19,15.24 | IC7.3 53.66,4.45 65.41,4.45 v70.48,9.53
N$55
  Top 0.406: R32.1 58.1,36.09 58.1,38.73 58.74,39.37 60.96,39.37 61.59,40.01 61.59,40.64 | 61.59,40.64 U6.6 TP3.TP | R35.1 66.99,40.32 66.04,41.27 64.77,41.27 64.14,40.64 61.59,40.64
N$56
  Top 0.406: R34.1 IC1.8 68.31,37.88 R35.2
N$64
  Top 0.406: R55.2 R53.1 84.88,35.34 85.09,35.56 IC3.7 85.09,37.47
N$65
  Bottom 0.305: U3.5 84.72,25.77 84.45,26.04 82.18,26.04 IC10.1
N$66
  Top 0.305: R41.1 54.61,34.61 54.29,34.29 53.66,34.29 53.34,33.97 R42.2
  Top 0.406: U7.2 R41.1
N$67
  Top 0.305: R40.1 55.88,34.61 56.2,34.29 56.83,34.29 57.15,33.97 R43.2
  Top 0.406: U7.3 R40.1
N$68  (via drill 0.3)
  Top 0.406: IC1.5 73.8,38.16 C4.1 74.06,38.34 75.56,36.83 75.56,33.02 v78.74,29.84
  Bottom 0.406: R22.1 84.45,12.7 73.98,23.18 73.98,25.08 v78.74,29.84
N$69
  Top 0.406: R44.2 C4.2
N$70  (via drill 0.3)
  Top 0.406: R42.1 52.39,36.09 52.39,38.73 53.02,39.37 55.24,39.37 55.88,40.01 U7.6 v55.88,44.45 57.78,44.45 TP4.TP | R45.1 v65.41,40.48
  Bottom 0.406: v65.41,40.48 63.98,41.91 57.78,41.91 55.88,43.81 v55.88,44.45
N$71
  Top 0.406: R44.1 73.82,32.96 IC1.4 72.39,34.13 70.33,36.2 66.04,36.2 65.41,36.83 R45.2
N$74  (via drill 0.3)
  Top 0.406: v24.13,23.18 23.65,23.65 R37.P$1 | R56.2 31.59,14.66 v31.59,18.41
  Bottom 0.406: v31.59,18.41 28.89,18.41 v24.13,23.18
  Bottom 6.452: D3.A R37.P$1 | R37.P$1 | R37.P$1 12.38,23.81 6.35,29.84 6.35,17.62 R37.P$1
N$79
  Top 0.406: IC11.5 40.48,12.91 R63.2 46.99,12.91 | 46.99,12.91 65.19,12.91 65.72,12.38 72.07,12.38 73.66,13.97 73.66,25.61 R65.2 | TP6.TP 46.99,12.91
N$80
  Top 0.406: R58.2 IC11.8 34.87,14.61 R56.1
N$81
  Top 0.406: R57.1 34.87,9.53 IC11.1 R59.2
N$82  (via drill 0.3)
  Top 0.406: C13.1 76.52,22.62 v76.52,24.13 76.52,25.03 R64.1
  Bottom 0.406: IC10.6 76.83,24.44 v76.52,24.13
N$83  (via drill 0.3)
  Top 0.406: IC11.7 35.88,14.98 35.88,17.68 34.98,18.57 | 34.98,18.57 R58.1 | 34.98,18.57 v34.29,18.57 | v38.73,19.53 46.99,19.53 | 46.99,19.53 60.48,19.53 66.67,13.34 71.75,13.34 72.39,13.97 72.39,27.3 73.66,28.57 75.56,28.57 76.36,27.78 R64.2 | TP5.TP 46.99,19.53
  Bottom 0.406: v34.29,18.57 34.61,18.26 37.47,18.26 v38.73,19.53
N$84
  Top 0.406: U_SENSE.2 37.47,4.29 R60.2
N$85
  Top 0.406: IC11.3 R60.1 R61.2
N$86
  Top 0.406: R62.2 IC11.4 40.48,11.21 R63.1
N$88  (via drill 0.3)
  Top 0.406: 74.93,22.86 C14.1 74.93,24.13 | R65.1 74.93,24.13 | 74.93,24.13 v75.56,24.13
  Bottom 0.406: IC10.7 76.21,25.09 75.56,24.45 v75.56,24.13
N$89  (via drill 0.3)
  Top 0.406: R68.1 93.13,34.55 v93.66,35.08
  Bottom 0.305: IC10.5 78.14,21.56 78.74,20.95 93.98,20.95 94.61,21.59 94.61,34.13 v93.66,35.08
N$90
  Top 0.406: JP2.7 96.1,38.1 R66.2
N$91  (via drill 0.3)
  Top 0.406: v92.08,39.37 R67.1
  Bottom 0.305: U3.1 84.75,23.2 86.36,21.59 93.34,21.59 93.98,22.23 93.98,33.66 92.71,34.92 92.71,38.73 v92.08,39.37
N$92  (via drill 0.3)
  Top 0.406: v92.08,36.83 R66.1
  Bottom 0.305: U3.9 88.4,24.27 88.27,24.13 88.27,22.86 88.9,22.23 92.71,22.23 93.34,22.86 93.34,33.02 92.08,34.29 v92.08,36.83
N$93
  Top 0.406: JP2.8 96.1,40.64 R67.2
N$94
  Top 0.406: JP2.6 96.1,35.56 R68.2
POS_INPUT1
  Bottom 12.7: 20.32,17.14 26.04,11.43 43.18,11.43 44.45,12.7 60.33,12.7 65.41,17.78
  Bottom 3.81: Q1.D 8.89,47.31 8.89,45.72 | 79.38,4.45 79.38,2.86 Q4.D | 78.74,46.35 79.06,46.67 Q3.D | 9.53,3.81 9.21,3.49 Q2.D | 17.14,32.38 17.46,32.7 | D3.C 8.89,41.91
  Bottom 6.452: 8.89,45.72 8.89,41.91 8.89,38.1 12.7,34.29 15.88,34.29 17.46,32.7 20.32,29.84 20.32,17.14 9.53,6.35 9.53,3.81 | 79.38,4.45 79.38,12.06 73.03,18.41 66.04,18.41 65.41,17.78 64.77,17.78 62.87,19.68 75.56,32.38 75.56,40.01 78.74,43.18 78.74,46.35

### Text on the board
tPlace: I1 | I2 | I3 | I4 | TEMP1 | T1 | TEMP2 | ElectronicLoad | 3 | 1 | DOUT | CS_ADC | MUX_ADC | CS_DAC | DIN | SCLK | CURRENT | 5V | GND | REF / (2V5) | DAC | AnalogBoard V1.2 | CURRENT | VOLTAGE | GND | ADC | 2 | -15V | 4 | +5V | T2 | +V_SENSE | -V_SENSE | +15V
bPlace: -LOAD | +LOAD